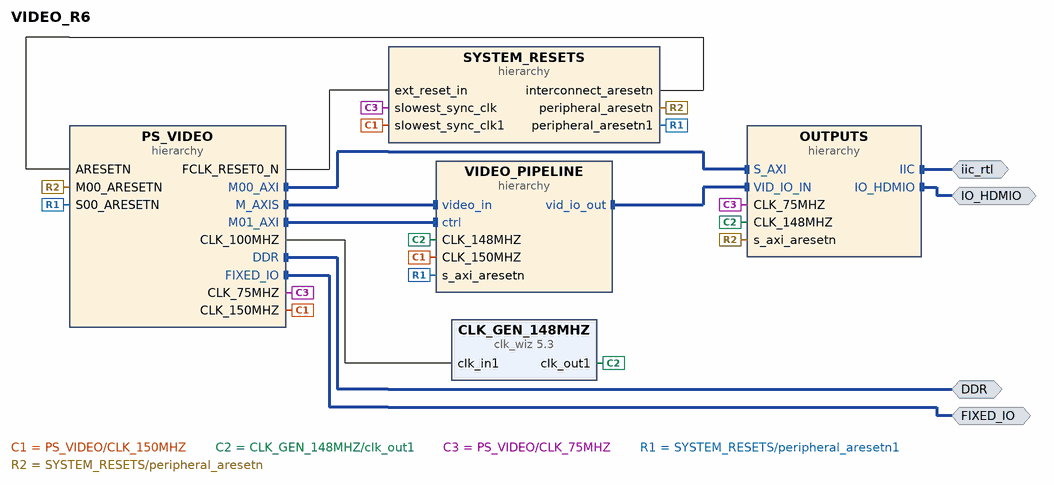
[diagram p0: block diagram of the top level]
# Vivado block design VIDEO_R6, xc7z020clg484-1, Vivado 2016.3
create_bd_design VIDEO_R6

create_bd_intf_port -mode Master -vlnv xilinx.com:interface:ddrx_rtl:1.0 DDR
create_bd_intf_port -mode Master -vlnv xilinx.com:display_processing_system7:fixedio_rtl:1.0 FIXED_IO
create_bd_intf_port -mode Master -vlnv avnet.com:interface:avnet_hdmi_rtl:1.0 IO_HDMIO
create_bd_intf_port -mode Master -vlnv xilinx.com:interface:iic_rtl:1.0 iic_rtl

create_bd_cell -type ip -vlnv xilinx.com:ip:clk_wiz:5.3 CLK_GEN_148MHZ
set_property -dict [list \
  CONFIG.CLKOUT1_REQUESTED_OUT_FREQ 148.500 \
  CONFIG.USE_LOCKED false \
  CONFIG.USE_RESET false \
  CONFIG.MMCM_DIVCLK_DIVIDE 4 \
  CONFIG.MMCM_CLKFBOUT_MULT_F 37.125 \
  CONFIG.MMCM_CLKOUT0_DIVIDE_F 6.250 \
  CONFIG.CLK_IN1_BOARD_INTERFACE Custom \
  CONFIG.CLK_IN2_BOARD_INTERFACE Custom \
  CONFIG.RESET_BOARD_INTERFACE Custom \
  CONFIG.CLKOUT1_JITTER 217.614 \
  CONFIG.CLKOUT1_PHASE_ERROR 245.344 \
] [get_bd_cells CLK_GEN_148MHZ]
create_bd_cell -type hier VIDEO_PIPELINE
create_bd_cell -type hier OUTPUTS
create_bd_cell -type hier PS_VIDEO
create_bd_cell -type hier SYSTEM_RESETS

# ---- hierarchy /VIDEO_PIPELINE ----
current_bd_instance /VIDEO_PIPELINE
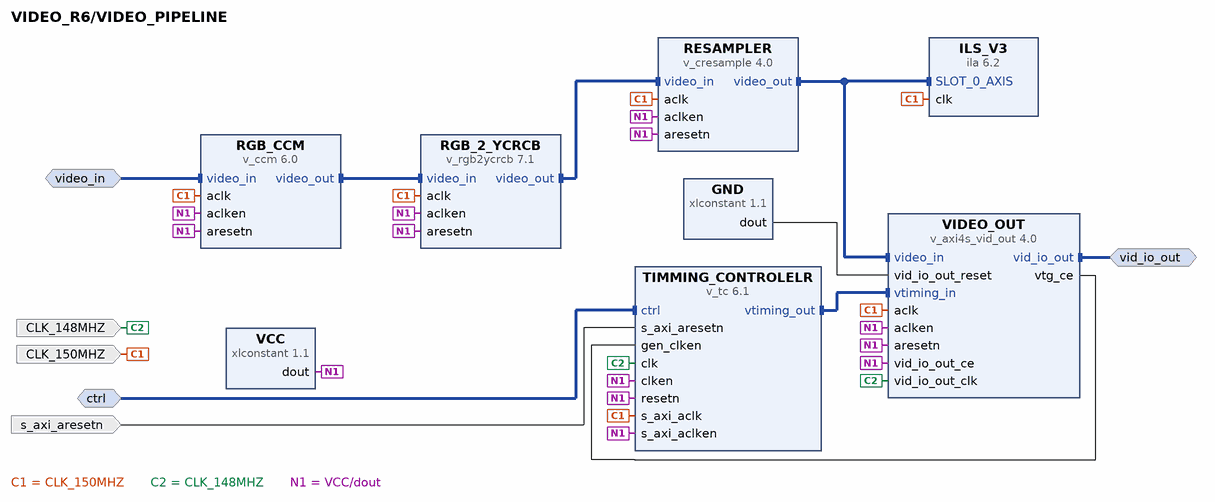
[diagram p1: block diagram inside /VIDEO_PIPELINE]
create_bd_intf_pin -mode Master -vlnv xilinx.com:interface:vid_io_rtl:1.0 vid_io_out
create_bd_intf_pin -mode Slave -vlnv xilinx.com:interface:axis_rtl:1.0 video_in
create_bd_intf_pin -mode Slave -vlnv xilinx.com:interface:aximm_rtl:1.0 ctrl
create_bd_pin -dir I -type clk CLK_150MHZ
create_bd_pin -dir I -type clk CLK_148MHZ
create_bd_pin -dir I -type rst s_axi_aresetn

create_bd_cell -type ip -vlnv xilinx.com:ip:v_axi4s_vid_out:4.0 VIDEO_OUT
set_property -dict [list \
  CONFIG.C_S_AXIS_VIDEO_FORMAT 0 \
  CONFIG.C_S_AXIS_VIDEO_DATA_WIDTH 8 \
  CONFIG.C_HAS_ASYNC_CLK 1 \
  CONFIG.C_VTG_MASTER_SLAVE 1 \
] [get_bd_cells VIDEO_OUT]
create_bd_cell -type ip -vlnv xilinx.com:ip:xlconstant:1.1 GND
set_property -dict {CONFIG.CONST_VAL 0} [get_bd_cells GND]
create_bd_cell -type ip -vlnv xilinx.com:ip:xlconstant:1.1 VCC
set_property -dict {CONFIG.CONST_VAL 1} [get_bd_cells VCC]
create_bd_cell -type ip -vlnv xilinx.com:ip:v_tc:6.1 TIMMING_CONTROLELR
set_property -dict [list \
  CONFIG.HAS_INTC_IF false \
  CONFIG.INTERLACE_EN false \
  CONFIG.enable_detection false \
  CONFIG.enable_generation true \
] [get_bd_cells TIMMING_CONTROLELR]
create_bd_cell -type ip -vlnv xilinx.com:ip:v_cresample:4.0 RESAMPLER
set_property -dict [list \
  CONFIG.s_axis_video_data_width 8 \
  CONFIG.s_axis_video_format 3 \
  CONFIG.m_axis_video_format 2 \
] [get_bd_cells RESAMPLER]
create_bd_cell -type ip -vlnv xilinx.com:ip:v_rgb2ycrcb:7.1 RGB_2_YCRCB
set_property -dict {CONFIG.S_AXIS_VIDEO_DATA_WIDTH 8} [get_bd_cells RGB_2_YCRCB]
create_bd_cell -type ip -vlnv xilinx.com:ip:v_ccm:6.0 RGB_CCM
create_bd_cell -type ip -vlnv xilinx.com:ip:ila:6.2 ILS_V3
set_property -dict {CONFIG.C_DATA_DEPTH 8192 CONFIG.C_NUM_OF_PROBES 9 CONFIG.C_SLOT_0_AXI_PROTOCOL AXI4S} [get_bd_cells ILS_V3]

# ---- hierarchy /OUTPUTS ----
current_bd_instance /OUTPUTS
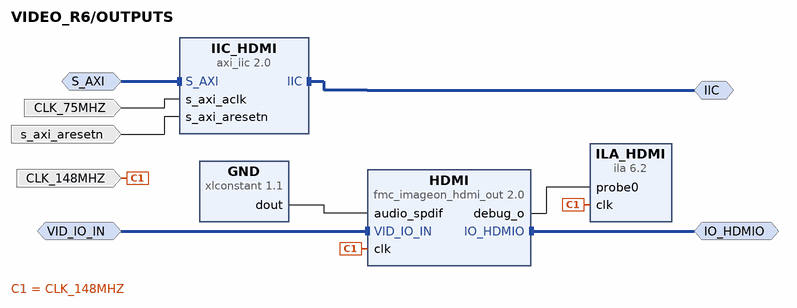
[diagram p2: block diagram inside /OUTPUTS]
create_bd_intf_pin -mode Master -vlnv xilinx.com:interface:iic_rtl:1.0 IIC
create_bd_intf_pin -mode Master -vlnv avnet.com:interface:avnet_hdmi_rtl:1.0 IO_HDMIO
create_bd_intf_pin -mode Slave -vlnv xilinx.com:interface:vid_io_rtl:1.0 VID_IO_IN
create_bd_intf_pin -mode Slave -vlnv xilinx.com:interface:aximm_rtl:1.0 S_AXI
create_bd_pin -dir I -type clk CLK_75MHZ
create_bd_pin -dir I CLK_148MHZ
create_bd_pin -dir I -type rst s_axi_aresetn

create_bd_cell -type ip -vlnv xilinx.com:ip:axi_iic:2.0 IIC_HDMI
create_bd_cell -type ip -vlnv ProjectTollgate:ProjectTollgate:fmc_imageon_hdmi_out:2.0 HDMI
set_property -dict {CONFIG.C_DEBUG_PORT true} [get_bd_cells HDMI]
create_bd_cell -type ip -vlnv xilinx.com:ip:ila:6.2 ILA_HDMI
set_property -dict [list \
  CONFIG.C_PROBE0_WIDTH 19 \
  CONFIG.C_DATA_DEPTH 4096 \
  CONFIG.C_NUM_OF_PROBES 1 \
  CONFIG.C_SLOT_0_AXI_PROTOCOL AXI4S \
  CONFIG.C_ENABLE_ILA_AXI_MON false \
  CONFIG.C_MONITOR_TYPE Native \
] [get_bd_cells ILA_HDMI]
create_bd_cell -type ip -vlnv xilinx.com:ip:xlconstant:1.1 GND
set_property -dict {CONFIG.CONST_VAL 0} [get_bd_cells GND]

# ---- hierarchy /PS_VIDEO ----
current_bd_instance /PS_VIDEO
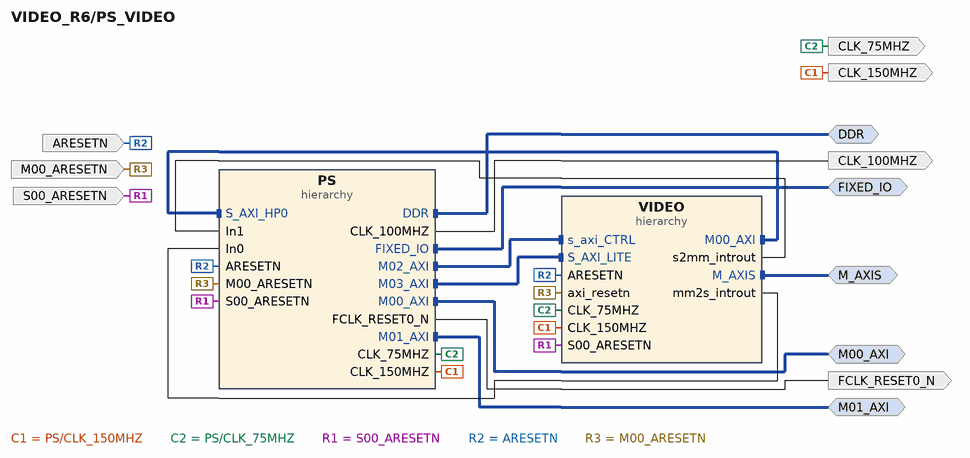
[diagram p3: block diagram inside /PS_VIDEO]
create_bd_intf_pin -mode Master -vlnv xilinx.com:interface:ddrx_rtl:1.0 DDR
create_bd_intf_pin -mode Master -vlnv xilinx.com:display_processing_system7:fixedio_rtl:1.0 FIXED_IO
create_bd_intf_pin -mode Master -vlnv xilinx.com:interface:axis_rtl:1.0 M_AXIS
create_bd_intf_pin -mode Master -vlnv xilinx.com:interface:aximm_rtl:1.0 M00_AXI
create_bd_intf_pin -mode Master -vlnv xilinx.com:interface:aximm_rtl:1.0 M01_AXI
create_bd_pin -dir O -type clk CLK_75MHZ
create_bd_pin -dir O -type clk CLK_100MHZ
create_bd_pin -dir O -type clk CLK_150MHZ
create_bd_pin -dir O -type rst FCLK_RESET0_N
create_bd_pin -dir I -type rst S00_ARESETN
create_bd_pin -dir I -type rst ARESETN
create_bd_pin -dir I -type rst M00_ARESETN

create_bd_cell -type hier VIDEO
create_bd_cell -type hier PS

# ---- hierarchy /PS_VIDEO/VIDEO ----
current_bd_instance /PS_VIDEO/VIDEO
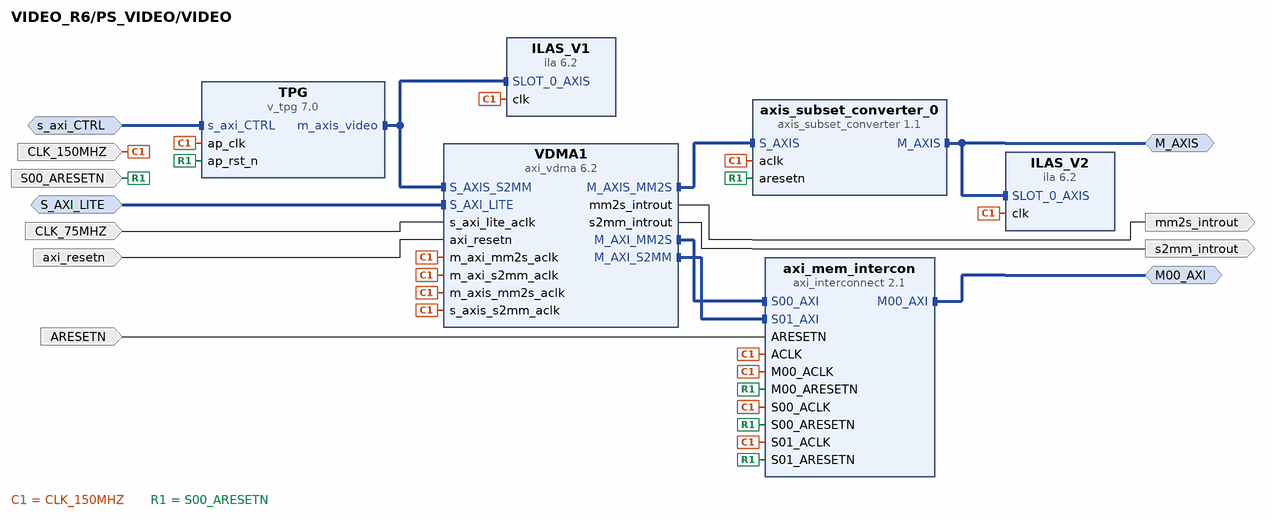
[diagram p4: block diagram inside /PS_VIDEO/VIDEO]
create_bd_intf_pin -mode Master -vlnv xilinx.com:interface:axis_rtl:1.0 M_AXIS
create_bd_intf_pin -mode Master -vlnv xilinx.com:interface:aximm_rtl:1.0 M00_AXI
create_bd_intf_pin -mode Slave -vlnv xilinx.com:interface:aximm_rtl:1.0 s_axi_CTRL
create_bd_intf_pin -mode Slave -vlnv xilinx.com:interface:aximm_rtl:1.0 S_AXI_LITE
create_bd_pin -dir I -type clk CLK_150MHZ
create_bd_pin -dir O -type intr mm2s_introut
create_bd_pin -dir O -type intr s2mm_introut
create_bd_pin -dir I CLK_75MHZ
create_bd_pin -dir I -type rst S00_ARESETN
create_bd_pin -dir I -type rst ARESETN
create_bd_pin -dir I -type rst axi_resetn

create_bd_cell -type ip -vlnv xilinx.com:ip:v_tpg:7.0 TPG
set_property -dict [list \
  CONFIG.MAX_COLS 1920 \
  CONFIG.MAX_ROWS 1080 \
  CONFIG.SOLID_COLOR 0 \
  CONFIG.RAMP 0 \
  CONFIG.DISPLAY_PORT 0 \
  CONFIG.COLOR_SWEEP 0 \
  CONFIG.ZONE_PLATE 0 \
  CONFIG.FOREGROUND 0 \
] [get_bd_cells TPG]
create_bd_cell -type ip -vlnv xilinx.com:ip:axi_vdma:6.2 VDMA1
set_property -dict [list \
  CONFIG.c_m_axi_s2mm_data_width 64 \
  CONFIG.c_use_s2mm_fsync 0 \
  CONFIG.c_mm2s_genlock_mode 3 \
  CONFIG.c_s2mm_genlock_mode 2 \
] [get_bd_cells VDMA1]
create_bd_cell -type ip -vlnv xilinx.com:ip:axis_subset_converter:1.1 axis_subset_converter_0
set_property -dict [list \
  CONFIG.S_TDATA_NUM_BYTES 4 \
  CONFIG.M_TDATA_NUM_BYTES 3 \
  CONFIG.S_TUSER_WIDTH 1 \
  CONFIG.M_TUSER_WIDTH 1 \
  CONFIG.S_HAS_TKEEP 1 \
  CONFIG.S_HAS_TLAST 1 \
  CONFIG.M_HAS_TKEEP 1 \
  CONFIG.M_HAS_TLAST 1 \
  CONFIG.TDATA_REMAP {tdata[23:0]} \
  CONFIG.TUSER_REMAP {tuser[0:0]} \
  CONFIG.TKEEP_REMAP {tkeep[2:0]} \
  CONFIG.TLAST_REMAP {tlast[0]} \
] [get_bd_cells axis_subset_converter_0]
create_bd_cell -type ip -vlnv xilinx.com:ip:axi_interconnect:2.1 axi_mem_intercon
set_property -dict {CONFIG.NUM_SI 2 CONFIG.NUM_MI 1} [get_bd_cells axi_mem_intercon]
create_bd_cell -type ip -vlnv xilinx.com:ip:ila:6.2 ILAS_V1
set_property -dict {CONFIG.C_DATA_DEPTH 4096 CONFIG.C_NUM_OF_PROBES 9 CONFIG.C_SLOT_0_AXI_PROTOCOL AXI4S} [get_bd_cells ILAS_V1]
create_bd_cell -type ip -vlnv xilinx.com:ip:ila:6.2 ILAS_V2
set_property -dict {CONFIG.C_DATA_DEPTH 4096 CONFIG.C_NUM_OF_PROBES 9 CONFIG.C_SLOT_0_AXI_PROTOCOL AXI4S} [get_bd_cells ILAS_V2]

# ---- hierarchy /PS_VIDEO/PS ----
current_bd_instance /PS_VIDEO/PS
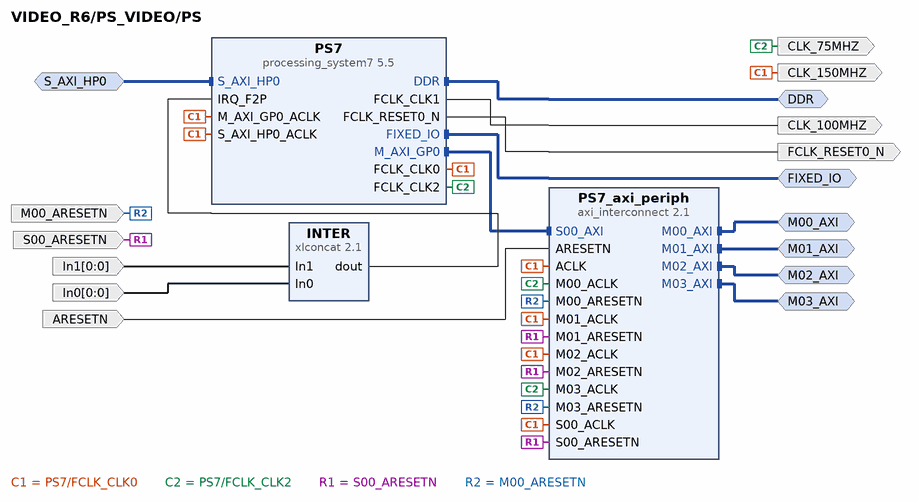
[diagram p5: block diagram inside /PS_VIDEO/PS]
create_bd_intf_pin -mode Master -vlnv xilinx.com:interface:ddrx_rtl:1.0 DDR
create_bd_intf_pin -mode Master -vlnv xilinx.com:display_processing_system7:fixedio_rtl:1.0 FIXED_IO
create_bd_intf_pin -mode Master -vlnv xilinx.com:interface:aximm_rtl:1.0 M00_AXI
create_bd_intf_pin -mode Master -vlnv xilinx.com:interface:aximm_rtl:1.0 M01_AXI
create_bd_intf_pin -mode Slave -vlnv xilinx.com:interface:aximm_rtl:1.0 S_AXI_HP0
create_bd_intf_pin -mode Master -vlnv xilinx.com:interface:aximm_rtl:1.0 M02_AXI
create_bd_intf_pin -mode Master -vlnv xilinx.com:interface:aximm_rtl:1.0 M03_AXI
create_bd_pin -dir O -type rst FCLK_RESET0_N
create_bd_pin -dir O -type clk CLK_100MHZ
create_bd_pin -dir O -type clk CLK_150MHZ
create_bd_pin -dir O -type clk CLK_75MHZ
create_bd_pin -dir I -from 0 -to 0 In1
create_bd_pin -dir I -from 0 -to 0 In0
create_bd_pin -dir I -type rst S00_ARESETN
create_bd_pin -dir I -type rst ARESETN
create_bd_pin -dir I -type rst M00_ARESETN

create_bd_cell -type ip -vlnv xilinx.com:ip:processing_system7:5.5 PS7
set_property -dict [list \
  CONFIG.PCW_FPGA0_PERIPHERAL_FREQMHZ 150.000000 \
  CONFIG.PCW_FPGA1_PERIPHERAL_FREQMHZ 100.000000 \
  CONFIG.PCW_FPGA2_PERIPHERAL_FREQMHZ 75.000000 \
  CONFIG.PCW_USE_S_AXI_HP0 1 \
  CONFIG.PCW_USE_FABRIC_INTERRUPT 1 \
  CONFIG.PCW_EN_CLK1_PORT 1 \
  CONFIG.PCW_EN_CLK2_PORT 1 \
  CONFIG.PCW_IRQ_F2P_INTR 1 \
  CONFIG.PCW_ENET0_PERIPHERAL_ENABLE 0 \
  CONFIG.PCW_USB0_PERIPHERAL_ENABLE 0 \
  CONFIG.preset ZedBoard \
] [get_bd_cells PS7]
# 2 more settings of PS7 are not shown: defaults, MIO pin electricals, DDR timing, and values the tool derives
create_bd_cell -type ip -vlnv xilinx.com:ip:xlconcat:2.1 INTER
create_bd_cell -type ip -vlnv xilinx.com:ip:axi_interconnect:2.1 PS7_axi_periph
set_property -dict {CONFIG.NUM_MI 4} [get_bd_cells PS7_axi_periph]

# ---- hierarchy /SYSTEM_RESETS ----
current_bd_instance /SYSTEM_RESETS
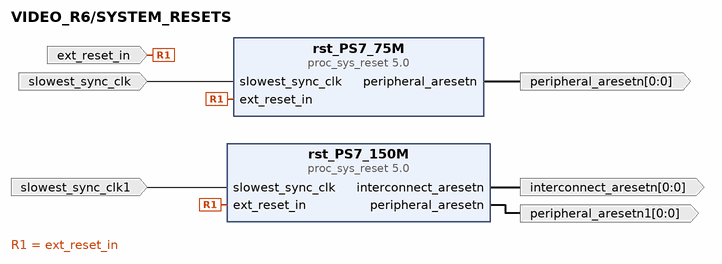
[diagram p6: block diagram inside /SYSTEM_RESETS]
create_bd_pin -dir I -type clk slowest_sync_clk
create_bd_pin -dir I -type rst ext_reset_in
create_bd_pin -dir O -from 0 -to 0 -type rst peripheral_aresetn
create_bd_pin -dir I -type clk slowest_sync_clk1
create_bd_pin -dir O -from 0 -to 0 -type rst interconnect_aresetn
create_bd_pin -dir O -from 0 -to 0 -type rst peripheral_aresetn1

create_bd_cell -type ip -vlnv xilinx.com:ip:proc_sys_reset:5.0 rst_PS7_75M
create_bd_cell -type ip -vlnv xilinx.com:ip:proc_sys_reset:5.0 rst_PS7_150M

# ---- connections ----

current_bd_instance /VIDEO_PIPELINE
connect_bd_intf_net [get_bd_intf_pins VIDEO_OUT/video_in] [get_bd_intf_pins RESAMPLER/video_out]
connect_bd_intf_net [get_bd_intf_pins VIDEO_OUT/video_in] [get_bd_intf_pins ILS_V3/SLOT_0_AXIS]
connect_bd_intf_net [get_bd_intf_pins VIDEO_OUT/vtiming_in] [get_bd_intf_pins TIMMING_CONTROLELR/vtiming_out]
connect_bd_intf_net [get_bd_intf_pins RGB_CCM/video_out] [get_bd_intf_pins RGB_2_YCRCB/video_in]
connect_bd_intf_net [get_bd_intf_pins RESAMPLER/video_in] [get_bd_intf_pins RGB_2_YCRCB/video_out]
connect_bd_intf_net [get_bd_intf_pins vid_io_out] [get_bd_intf_pins VIDEO_OUT/vid_io_out]
connect_bd_intf_net [get_bd_intf_pins video_in] [get_bd_intf_pins RGB_CCM/video_in]
connect_bd_intf_net [get_bd_intf_pins ctrl] [get_bd_intf_pins TIMMING_CONTROLELR/ctrl]
connect_bd_net -net aclk_1 [get_bd_pins CLK_150MHZ] \
  [get_bd_pins VIDEO_OUT/aclk] [get_bd_pins TIMMING_CONTROLELR/s_axi_aclk] [get_bd_pins RESAMPLER/aclk] \
  [get_bd_pins RGB_2_YCRCB/aclk] [get_bd_pins RGB_CCM/aclk] [get_bd_pins ILS_V3/clk]
connect_bd_net -net vid_io_out_clk_1 [get_bd_pins CLK_148MHZ] [get_bd_pins VIDEO_OUT/vid_io_out_clk] [get_bd_pins TIMMING_CONTROLELR/clk]
connect_bd_net [get_bd_pins GND/dout] [get_bd_pins VIDEO_OUT/vid_io_out_reset]
connect_bd_net [get_bd_pins VCC/dout] \
  [get_bd_pins VIDEO_OUT/vid_io_out_ce] [get_bd_pins VIDEO_OUT/aclken] [get_bd_pins TIMMING_CONTROLELR/resetn] \
  [get_bd_pins TIMMING_CONTROLELR/s_axi_aclken] [get_bd_pins TIMMING_CONTROLELR/clken] [get_bd_pins VIDEO_OUT/aresetn] \
  [get_bd_pins RGB_2_YCRCB/aresetn] [get_bd_pins RGB_2_YCRCB/aclken] [get_bd_pins RGB_CCM/aresetn] \
  [get_bd_pins RGB_CCM/aclken] [get_bd_pins RESAMPLER/aresetn] [get_bd_pins RESAMPLER/aclken]
connect_bd_net [get_bd_pins VIDEO_OUT/vtg_ce] [get_bd_pins TIMMING_CONTROLELR/gen_clken]
connect_bd_net [get_bd_pins s_axi_aresetn] [get_bd_pins TIMMING_CONTROLELR/s_axi_aresetn]

current_bd_instance /OUTPUTS
connect_bd_intf_net [get_bd_intf_pins IIC] [get_bd_intf_pins IIC_HDMI/IIC]
connect_bd_intf_net [get_bd_intf_pins IO_HDMIO] [get_bd_intf_pins HDMI/IO_HDMIO]
connect_bd_intf_net [get_bd_intf_pins VID_IO_IN] [get_bd_intf_pins HDMI/VID_IO_IN]
connect_bd_intf_net [get_bd_intf_pins S_AXI] [get_bd_intf_pins IIC_HDMI/S_AXI]
connect_bd_net -net s_axi_aclk_1 [get_bd_pins CLK_75MHZ] [get_bd_pins IIC_HDMI/s_axi_aclk]
connect_bd_net -net clk_1 [get_bd_pins CLK_148MHZ] [get_bd_pins HDMI/clk] [get_bd_pins ILA_HDMI/clk]
connect_bd_net -net HDMIOUT_debug_o [get_bd_pins HDMI/debug_o] [get_bd_pins ILA_HDMI/probe0]
connect_bd_net [get_bd_pins GND/dout] [get_bd_pins HDMI/audio_spdif]
connect_bd_net [get_bd_pins s_axi_aresetn] [get_bd_pins IIC_HDMI/s_axi_aresetn]

current_bd_instance /PS_VIDEO
connect_bd_intf_net [get_bd_intf_pins VIDEO/M00_AXI] [get_bd_intf_pins PS/S_AXI_HP0]
connect_bd_intf_net [get_bd_intf_pins PS/M02_AXI] [get_bd_intf_pins VIDEO/s_axi_CTRL]
connect_bd_intf_net [get_bd_intf_pins PS/M03_AXI] [get_bd_intf_pins VIDEO/S_AXI_LITE]
connect_bd_intf_net [get_bd_intf_pins DDR] [get_bd_intf_pins PS/DDR]
connect_bd_intf_net [get_bd_intf_pins FIXED_IO] [get_bd_intf_pins PS/FIXED_IO]
connect_bd_intf_net [get_bd_intf_pins M_AXIS] [get_bd_intf_pins VIDEO/M_AXIS]
connect_bd_intf_net [get_bd_intf_pins M00_AXI] [get_bd_intf_pins PS/M00_AXI]
connect_bd_intf_net [get_bd_intf_pins M01_AXI] [get_bd_intf_pins PS/M01_AXI]
connect_bd_net -net PS7_FCLK_CLK0 [get_bd_pins PS/CLK_150MHZ] [get_bd_pins CLK_150MHZ] [get_bd_pins VIDEO/CLK_150MHZ]
connect_bd_net -net PS7_FCLK_CLK2 [get_bd_pins PS/CLK_75MHZ] [get_bd_pins CLK_75MHZ] [get_bd_pins VIDEO/CLK_75MHZ]
connect_bd_net -net PS_FCLK_CLK1 [get_bd_pins PS/CLK_100MHZ] [get_bd_pins CLK_100MHZ]
connect_bd_net [get_bd_pins VIDEO/s2mm_introut] [get_bd_pins PS/In1]
connect_bd_net [get_bd_pins VIDEO/mm2s_introut] [get_bd_pins PS/In0]
connect_bd_net [get_bd_pins PS/FCLK_RESET0_N] [get_bd_pins FCLK_RESET0_N]
connect_bd_net [get_bd_pins S00_ARESETN] [get_bd_pins PS/S00_ARESETN] [get_bd_pins VIDEO/S00_ARESETN]
connect_bd_net [get_bd_pins ARESETN] [get_bd_pins PS/ARESETN] [get_bd_pins VIDEO/ARESETN]
connect_bd_net [get_bd_pins M00_ARESETN] [get_bd_pins PS/M00_ARESETN] [get_bd_pins VIDEO/axi_resetn]

current_bd_instance /PS_VIDEO/VIDEO
connect_bd_intf_net [get_bd_intf_pins axis_subset_converter_0/S_AXIS] [get_bd_intf_pins VDMA1/M_AXIS_MM2S]
connect_bd_intf_net [get_bd_intf_pins TPG/m_axis_video] [get_bd_intf_pins VDMA1/S_AXIS_S2MM]
connect_bd_intf_net [get_bd_intf_pins TPG/m_axis_video] [get_bd_intf_pins ILAS_V1/SLOT_0_AXIS]
connect_bd_intf_net [get_bd_intf_pins VDMA1/M_AXI_MM2S] [get_bd_intf_pins axi_mem_intercon/S00_AXI]
connect_bd_intf_net [get_bd_intf_pins VDMA1/M_AXI_S2MM] [get_bd_intf_pins axi_mem_intercon/S01_AXI]
connect_bd_intf_net [get_bd_intf_pins M_AXIS] [get_bd_intf_pins axis_subset_converter_0/M_AXIS]
connect_bd_intf_net [get_bd_intf_pins M_AXIS] [get_bd_intf_pins ILAS_V2/SLOT_0_AXIS]
connect_bd_intf_net [get_bd_intf_pins M00_AXI] [get_bd_intf_pins axi_mem_intercon/M00_AXI]
connect_bd_intf_net [get_bd_intf_pins s_axi_CTRL] [get_bd_intf_pins TPG/s_axi_CTRL]
connect_bd_intf_net [get_bd_intf_pins S_AXI_LITE] [get_bd_intf_pins VDMA1/S_AXI_LITE]
connect_bd_net -net ap_clk_1 [get_bd_pins CLK_150MHZ] \
  [get_bd_pins TPG/ap_clk] [get_bd_pins VDMA1/s_axis_s2mm_aclk] [get_bd_pins VDMA1/m_axis_mm2s_aclk] \
  [get_bd_pins VDMA1/m_axi_s2mm_aclk] [get_bd_pins VDMA1/m_axi_mm2s_aclk] [get_bd_pins axis_subset_converter_0/aclk] \
  [get_bd_pins axi_mem_intercon/S00_ACLK] [get_bd_pins axi_mem_intercon/ACLK] [get_bd_pins axi_mem_intercon/M00_ACLK] \
  [get_bd_pins axi_mem_intercon/S01_ACLK] [get_bd_pins ILAS_V1/clk] [get_bd_pins ILAS_V2/clk]
connect_bd_net [get_bd_pins VDMA1/mm2s_introut] [get_bd_pins mm2s_introut]
connect_bd_net [get_bd_pins VDMA1/s2mm_introut] [get_bd_pins s2mm_introut]
connect_bd_net [get_bd_pins CLK_75MHZ] [get_bd_pins VDMA1/s_axi_lite_aclk]
connect_bd_net [get_bd_pins S00_ARESETN] \
  [get_bd_pins axi_mem_intercon/S00_ARESETN] [get_bd_pins axi_mem_intercon/M00_ARESETN] [get_bd_pins TPG/ap_rst_n] \
  [get_bd_pins axi_mem_intercon/S01_ARESETN] [get_bd_pins axis_subset_converter_0/aresetn]
connect_bd_net [get_bd_pins ARESETN] [get_bd_pins axi_mem_intercon/ARESETN]
connect_bd_net [get_bd_pins axi_resetn] [get_bd_pins VDMA1/axi_resetn]

current_bd_instance /PS_VIDEO/PS
connect_bd_intf_net [get_bd_intf_pins PS7/M_AXI_GP0] [get_bd_intf_pins PS7_axi_periph/S00_AXI]
connect_bd_intf_net [get_bd_intf_pins DDR] [get_bd_intf_pins PS7/DDR]
connect_bd_intf_net [get_bd_intf_pins FIXED_IO] [get_bd_intf_pins PS7/FIXED_IO]
connect_bd_intf_net [get_bd_intf_pins M00_AXI] [get_bd_intf_pins PS7_axi_periph/M00_AXI]
connect_bd_intf_net [get_bd_intf_pins M01_AXI] [get_bd_intf_pins PS7_axi_periph/M01_AXI]
connect_bd_intf_net -intf_net S_AXI_HP0_1 [get_bd_intf_pins S_AXI_HP0] [get_bd_intf_pins PS7/S_AXI_HP0]
connect_bd_intf_net [get_bd_intf_pins M02_AXI] [get_bd_intf_pins PS7_axi_periph/M02_AXI]
connect_bd_intf_net [get_bd_intf_pins M03_AXI] [get_bd_intf_pins PS7_axi_periph/M03_AXI]
connect_bd_net [get_bd_pins PS7/FCLK_CLK0] \
  [get_bd_pins PS7/S_AXI_HP0_ACLK] [get_bd_pins PS7/M_AXI_GP0_ACLK] [get_bd_pins CLK_150MHZ] \
  [get_bd_pins PS7_axi_periph/S00_ACLK] [get_bd_pins PS7_axi_periph/ACLK] [get_bd_pins PS7_axi_periph/M01_ACLK] \
  [get_bd_pins PS7_axi_periph/M02_ACLK]
connect_bd_net [get_bd_pins PS7/FCLK_RESET0_N] [get_bd_pins FCLK_RESET0_N]
connect_bd_net [get_bd_pins PS7/FCLK_CLK1] [get_bd_pins CLK_100MHZ]
connect_bd_net [get_bd_pins PS7/FCLK_CLK2] [get_bd_pins CLK_75MHZ] [get_bd_pins PS7_axi_periph/M00_ACLK] [get_bd_pins PS7_axi_periph/M03_ACLK]
connect_bd_net [get_bd_pins INTER/dout] [get_bd_pins PS7/IRQ_F2P]
connect_bd_net -net In1_1 [get_bd_pins In1] [get_bd_pins INTER/In1]
connect_bd_net -net In0_1 [get_bd_pins In0] [get_bd_pins INTER/In0]
connect_bd_net [get_bd_pins S00_ARESETN] \
  [get_bd_pins PS7_axi_periph/S00_ARESETN] [get_bd_pins PS7_axi_periph/M01_ARESETN] [get_bd_pins PS7_axi_periph/M02_ARESETN]
connect_bd_net [get_bd_pins ARESETN] [get_bd_pins PS7_axi_periph/ARESETN]
connect_bd_net [get_bd_pins M00_ARESETN] [get_bd_pins PS7_axi_periph/M00_ARESETN] [get_bd_pins PS7_axi_periph/M03_ARESETN]

current_bd_instance /SYSTEM_RESETS
connect_bd_net -net PS7_FCLK_CLK2 [get_bd_pins slowest_sync_clk] [get_bd_pins rst_PS7_75M/slowest_sync_clk]
connect_bd_net -net PS_VIDEO_FCLK_RESET0_N [get_bd_pins ext_reset_in] [get_bd_pins rst_PS7_150M/ext_reset_in] [get_bd_pins rst_PS7_75M/ext_reset_in]
connect_bd_net [get_bd_pins rst_PS7_75M/peripheral_aresetn] [get_bd_pins peripheral_aresetn]
connect_bd_net -net processing_system7_0_FCLK_CLK0 [get_bd_pins slowest_sync_clk1] [get_bd_pins rst_PS7_150M/slowest_sync_clk]
connect_bd_net [get_bd_pins rst_PS7_150M/interconnect_aresetn] [get_bd_pins interconnect_aresetn]
connect_bd_net [get_bd_pins rst_PS7_150M/peripheral_aresetn] [get_bd_pins peripheral_aresetn1]

current_bd_instance /
connect_bd_intf_net [get_bd_intf_pins VIDEO_PIPELINE/vid_io_out] [get_bd_intf_pins OUTPUTS/VID_IO_IN]
connect_bd_intf_net [get_bd_intf_pins PS_VIDEO/M_AXIS] [get_bd_intf_pins VIDEO_PIPELINE/video_in]
connect_bd_intf_net [get_bd_intf_pins PS_VIDEO/M00_AXI] [get_bd_intf_pins OUTPUTS/S_AXI]
connect_bd_intf_net [get_bd_intf_pins PS_VIDEO/M01_AXI] [get_bd_intf_pins VIDEO_PIPELINE/ctrl]
connect_bd_intf_net [get_bd_intf_ports DDR] [get_bd_intf_pins PS_VIDEO/DDR]
connect_bd_intf_net [get_bd_intf_ports FIXED_IO] [get_bd_intf_pins PS_VIDEO/FIXED_IO]
connect_bd_intf_net [get_bd_intf_ports IO_HDMIO] [get_bd_intf_pins OUTPUTS/IO_HDMIO]
connect_bd_intf_net [get_bd_intf_ports iic_rtl] [get_bd_intf_pins OUTPUTS/IIC]
connect_bd_net -net processing_system7_0_FCLK_CLK0 [get_bd_pins PS_VIDEO/CLK_150MHZ] \
  [get_bd_pins VIDEO_PIPELINE/CLK_150MHZ] [get_bd_pins SYSTEM_RESETS/slowest_sync_clk1]
connect_bd_net -net clk_wiz_0_clk_out1 [get_bd_pins CLK_GEN_148MHZ/clk_out1] [get_bd_pins VIDEO_PIPELINE/CLK_148MHZ] [get_bd_pins OUTPUTS/CLK_148MHZ]
connect_bd_net -net PS7_FCLK_CLK2 [get_bd_pins PS_VIDEO/CLK_75MHZ] [get_bd_pins OUTPUTS/CLK_75MHZ] [get_bd_pins SYSTEM_RESETS/slowest_sync_clk]
connect_bd_net -net PS_VIDEO_FCLK_CLK1 [get_bd_pins PS_VIDEO/CLK_100MHZ] [get_bd_pins CLK_GEN_148MHZ/clk_in1]
connect_bd_net [get_bd_pins PS_VIDEO/FCLK_RESET0_N] [get_bd_pins SYSTEM_RESETS/ext_reset_in]
connect_bd_net -net rst_PS7_150M_peripheral_aresetn [get_bd_pins SYSTEM_RESETS/peripheral_aresetn1] \
  [get_bd_pins PS_VIDEO/S00_ARESETN] [get_bd_pins VIDEO_PIPELINE/s_axi_aresetn]
connect_bd_net -net rst_PS7_150M_interconnect_aresetn [get_bd_pins SYSTEM_RESETS/interconnect_aresetn] [get_bd_pins PS_VIDEO/ARESETN]
connect_bd_net -net rst_PS7_75M_peripheral_aresetn [get_bd_pins SYSTEM_RESETS/peripheral_aresetn] \
  [get_bd_pins OUTPUTS/s_axi_aresetn] [get_bd_pins PS_VIDEO/M00_ARESETN]

# ---- address map ----
assign_bd_address -offset 0x41600000 -range 64K -target_address_space [get_bd_addr_spaces PS_VIDEO/PS/PS7/Data] [get_bd_addr_segs OUTPUTS/IIC_HDMI/S_AXI/Reg]
assign_bd_address -offset 0x43000000 -range 64K -target_address_space [get_bd_addr_spaces PS_VIDEO/PS/PS7/Data] [get_bd_addr_segs PS_VIDEO/VIDEO/VDMA1/S_AXI_LITE/Reg]
assign_bd_address -offset 0x43C00000 -range 64K -target_address_space [get_bd_addr_spaces PS_VIDEO/PS/PS7/Data] [get_bd_addr_segs VIDEO_PIPELINE/TIMMING_CONTROLELR/ctrl/Reg]
assign_bd_address -offset 0x43C10000 -range 64K -target_address_space [get_bd_addr_spaces PS_VIDEO/PS/PS7/Data] [get_bd_addr_segs PS_VIDEO/VIDEO/TPG/s_axi_CTRL/Reg]
assign_bd_address -offset 0x00000000 -range 512M -target_address_space [get_bd_addr_spaces PS_VIDEO/VIDEO/VDMA1/Data_MM2S] [get_bd_addr_segs PS_VIDEO/PS/PS7/S_AXI_HP0/HP0_DDR_LOWOCM]
assign_bd_address -offset 0x00000000 -range 512M -target_address_space [get_bd_addr_spaces PS_VIDEO/VIDEO/VDMA1/Data_S2MM] [get_bd_addr_segs PS_VIDEO/PS/PS7/S_AXI_HP0/HP0_DDR_LOWOCM]

validate_bd_design
save_bd_design
